# Altium schematic sheet 3 LTE 2.SchDoc
size 594 x 420 mm; SheetNumber: 4; SheetTotal: 9
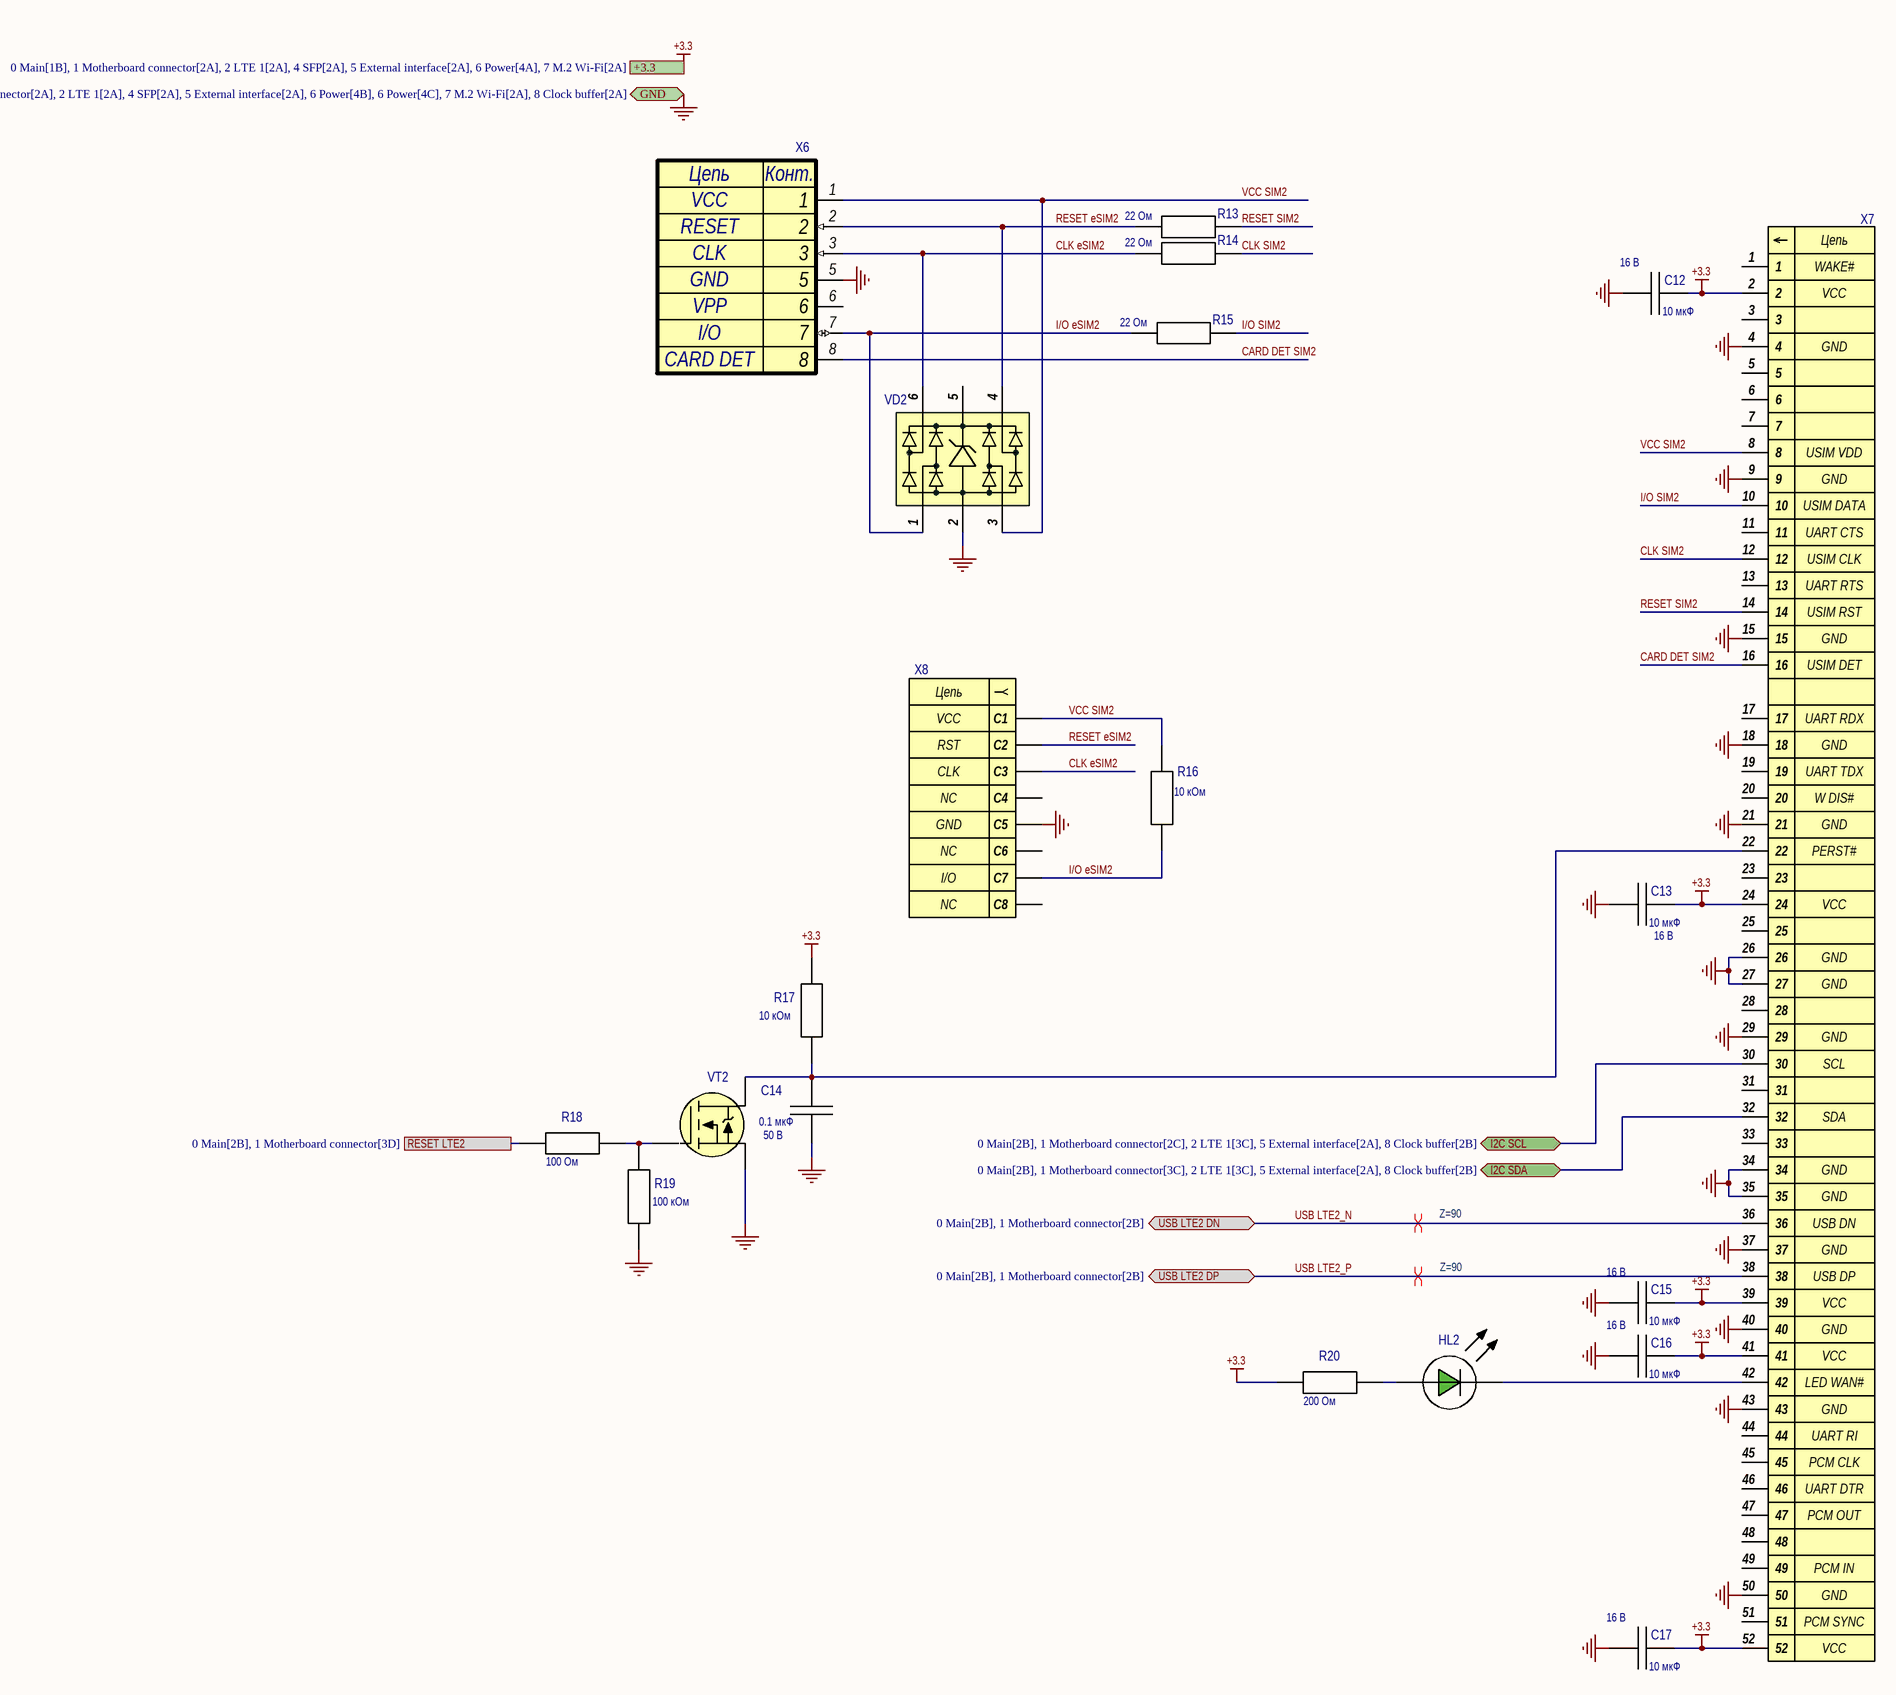
[diagram p0: 3 LTE 2.SchDoc]

## Parts
C12  value 10 мкФ  Напряжение: 16 В  [CAP_0805]
C13  value 10 мкФ  Напряжение: 16 В  [CAP_0805]
C14  value 0.1 мкФ  Напряжение: 50 В  [CAP_0402]
C15  value 10 мкФ  Напряжение: 16 В  [CAP_0805]
C16  value 10 мкФ  Напряжение: 16 В  [CAP_0805]
C17  value 10 мкФ  Напряжение: 16 В  [CAP_0805]
HL2  APHHS1005CGCK  [LED_0402_GREEN]  (value not drawn)
R13  value 22 Ом  [RES_0402]  (hidden comment: STD_RES)
R14  value 22 Ом  [RES_0402]  (hidden comment: STD_RES)
R15  value 22 Ом  [RES_0402]  (hidden comment: STD_RES)
R16  value 10 кОм  [RES_0402]  (hidden comment: STD_RES)
R17  value 10 кОм  [RES_0402]  (hidden comment: STD_RES)
R18  value 100 Ом  [RES_0402]  (hidden comment: STD_RES)
R19  value 100 кОм  [RES_0402]  (hidden comment: STD_RES)
R20  value 200 Ом  [RES_0402]  (hidden comment: STD_RES)
VD2  SRV05-4  [SOT-23-6]  (value not drawn)
VT2  2N7002P  [SOT-23-3]  (value not drawn)
X6  Sim холдер с детектированием sim-card  и выдвижным держателем SMN-327-KT1B  [SMN-328-ACP7]  (value not drawn)
X7  2041262-1  [2041262-1]  (value not drawn)
X8  SIM_MFF2  [SIM_MFF2]  (value not drawn)

## Ports
+3.3 (see 0 Main[1B], 1 Motherboard connector[2A], 2 LTE 1[2A], 4 SFP[2A], 5 External interface[2A], 6 Power[4A], 7 M.2 Wi-Fi[2A]), GND (bidir, see 0 Main[1B], 1 Motherboard connector[2A], 2 LTE 1[2A], 4 SFP[2A], 5 External interface[2A], 6 Power[4B], 6 Power[4C], 7 M.2 Wi-Fi[2A], 8 Clock buffer[2A]), I2C SCL (bidir, see 0 Main[2B], 1 Motherboard connector[2C], 2 LTE 1[3C], 5 External interface[2A], 8 Clock buffer[2B]), I2C SDA (bidir, see 0 Main[2B], 1 Motherboard connector[3C], 2 LTE 1[3C], 5 External interface[2A], 8 Clock buffer[2B]), RESET LTE2 (see 0 Main[2B], 1 Motherboard connector[3D]), USB LTE2 DN (bidir, see 0 Main[2B], 1 Motherboard connector[2B]), USB LTE2 DP (bidir, see 0 Main[2B], 1 Motherboard connector[2B])

## Nets
+3.3: C12.1 C13.1 C15.1 C16.1 C17.1 R17.2 R20.1 X7.2 X7.24 X7.39 X7.41 X7.52 ; port +3.3
GND: C12.2 C13.2 C14.2 C15.2 C16.2 C17.2 R19.1 VD2.2 VT2.2(S) X6.5 X7.4 X7.9 X7.15 X7.18 X7.21 X7.26 X7.27 X7.29 X7.34 X7.35 X7.37 X7.40 X7.43 X7.50 X8.C5 ; port GND
CARD DET SIM2: X6.8 X7.16
CLK eSIM2: R14.1 VD2.6 X6.3 X8.C3
CLK SIM2: R14.2 X7.12
I2C SCL: X7.30 ; port I2C SCL
I2C SDA: X7.32 ; port I2C SDA
I/O eSIM2: R15.1 R16.1 VD2.1 X6.7 X8.C7
I/O SIM2: R15.2 X7.10
RESET eSIM2: R13.1 VD2.4 X6.2 X8.C2
RESET LTE2: R18.1 ; port RESET LTE2
RESET SIM2: R13.2 X7.14
USB LTE2_N: X7.36 ; port USB LTE2 DN
USB LTE2_P: X7.38 ; port USB LTE2 DP
VCC SIM2: R16.2 VD2.3 X6.1 X7.8 X8.C1
NetC14_1: C14.1 R17.1 VT2.3(D) X7.22
NetHL2_1: HL2.1(A) R20.2
NetHL2_2: HL2.2(K) X7.42
NetR18_2: R18.2 R19.2 VT2.1(G)

Not connected (* = marked no-connect by the designer): VD2 5; X6 6; X7 1 3 5 6 7 11 13 17 19 20 23 25 28 31 33 44 45 46 47 48 49 51; X8 C4 C6 C8

## Layout directives
differential pair; differential pair class Z=90: USB LTE2_N, USB LTE2_P

## Notes on the sheet
- Перв. примен.
- Справ. №
- Подп. и дата
- Инв. № дубл.
- Взам. инв. №
- Инв. № подл.
- Изм.
- Лист
- № докум.
- Подп.
- Дата
- 2.106-A2
- Копировал
- Формат А2
- (in symbol 2041262-1) Цепь; WAKE#; VCC; GND; USIM VDD; USIM DATA; UART CTS; USIM CLK; UART RTS; USIM RST; USIM DET; UART RDX; UART TDX; W DIS#; PERST#; SCL; SDA; USB DN; USB DP; LED WAN#; UART RI; PCM CLK; UART DTR; PCM OUT; PCM IN; PCM SYNC
- (in symbol SIM_MFF2) Цепь; VCC; RST; CLK; NC; GND; I/O
- (in symbol SMN-328-ACP7) Цепь; Конт.; VCC; RESET; CLK; GND; VPP; I/O; CARD DET

## Library data of the parts
C12 C13 C15-C17 = GRM21BR61C106KE15L: Конденсатор CHIP-0805 10 мкФ 16 В 10% X5R; Manufacturer: MURATA; ID: 121; Температура: -55...+85°C; Autor: Цислав А.Н.; PartNumber: GRM21BR61C106KE15L; Type: CHIP-0805; Tolerance: 10%; Диэлектрик: X5R; Data: 09-05-2013
C14 = CC0402KRX7R9BB104: Конденсатор CHIP-0402 0.1 мкФ 50 В 10% X7R; Manufacturer: YAGEO; ID: 357; Температура: -55...+85°C; Autor: Admin; PartNumber: CC0402KRX7R9BB104; Type: CHIP-0402; Tolerance: 10%; Диэлектрик: X7R; Data: 10-04-2024
HL2 = APHHS1005CGCK: Диод Kingbright 2 В 20 мА; ID: 15; Type: LED; U_direct: 2 В; Current: 20 мА; Температура: -40...+85°C; Autor: Цислав А.Н.; PartNumber: APHHS1005CGCK; Manufacturer: Kingbright; Data: 04-30-2014
R13-R15 = RC0402FR-0722RL: Резистор CHIP-0402 22 Ом 1%; Manufacturer: YAGEO; ID: 272; ТКС: 100 ppm/K; Температура: -55...+155°C; Autor: Цислав А.Н.; PartNumber: RC0402FR-0722RL; Type: CHIP-0402; Tolerance: 1%; Data: 02-03-2014
R16 R17 = RC0402JR-0710KL: Резистор CHIP-0402 10 кОм 5%; Manufacturer: YAGEO; ID: 413; ТКС: 100 ppm/K; Температура: -55...+155°C; Autor: Цислав А.Н.; PartNumber: RC0402JR-0710KL; Type: CHIP-0402; Tolerance: 5%; Data: 02-03-2014
R18 = RC0402JR-07100RL: Резистор CHIP-0402 100 Ом 5%; Manufacturer: YAGEO; ID: 299; ТКС: 100 ppm/K; Температура: -55...+155°C; Autor: Цислав А.Н.; PartNumber: RC0402JR-07100RL; Type: CHIP-0402; Tolerance: 5%; Data: 02-03-2014
R19 = RC0402JR-07100KL: Резистор CHIP-0402 100 кОм 5%; Manufacturer: YAGEO; ID: 455; ТКС: 100 ppm/K; Температура: -55...+155°C; Autor: Цислав А.Н.; PartNumber: RC0402JR-07100KL; Type: CHIP-0402; Tolerance: 5%; Data: 02-03-2014
R20 = RC0402JR-07200RL: Резистор CHIP-0402 200 Ом 5%; Manufacturer: YAGEO; ID: 311; ТКС: 100 ppm/K; Температура: -55...+155°C; Autor: Цислав А.Н.; PartNumber: RC0402JR-07200RL; Type: CHIP-0402; Tolerance: 5%; Data: 02-03-2014
VD2 = SRV05-4: Диод SEMTECH 1.2 В 12 А; ID: 91; Type: Diode TVS; U_direct: 1.2 В; U_reverse: 5 В; Current: 12 А; Температура: -55...+125°C; Autor: Admin; PartNumber: SRV05-4; Manufacturer: SEMTECH; Data: 01-10-2018
VT2 = 2N7002P: Микросхема NXP  N-channel Trench MOSFET; ID: 321; Type: MOSFET N-Channel; Voltage: 60В; Current: 300 мА; Температура: -40...+85°C; Autor: Admin; PartNumber: 2N7002P; Value: N-channel Trench MOSFET; Manufacturer: NXP; Data: 05-24-2016
X6 = SMN-328-ACP7: Разъем XunPu SIM; ID: 370; Contact: 8; Autor: Admin; PartNumber: SMN-328-ACP7; Type: SIM; Pitch: -; Mounting: Поверхностный; Current: -; Manufacturer: XunPu; Data: 04-25-2024
X7 = 2041262-1: Разъем TE PCI-E; ID: 335; Contact: 52; Pitch: 0.8 мм; Current: 100 мА; Autor: Admin; PartNumber: 2041262-1; Type: PCI-E; Mounting: Поверхностный; Manufacturer: TE; Data: 11-21-2023
X8 = SIM_MFF2: Разъем E - SIM; Manufacturer: E -; ID: 259; Contact: 8; Pitch: 1.27 мм; Current: 100 мА; Autor: Admin; PartNumber: SIM_MFF2; Type: SIM; Mounting: Поверхностный; Data: 06-14-2019